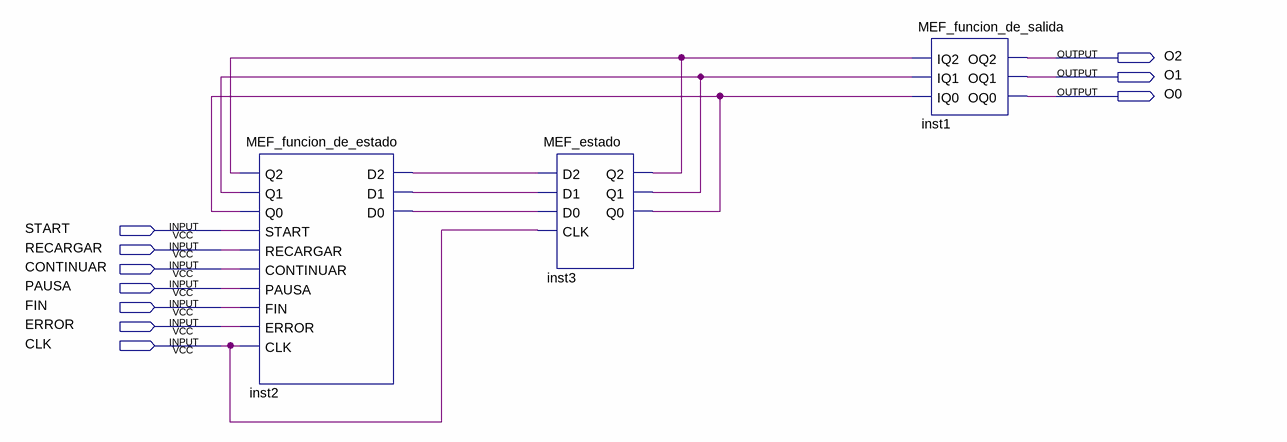
[diagram p0: schematic sheet]
// Quartus schematic MEF.bdf as structural Verilog: 3 symbols, 10 pins
module MEF (
  input  START,
  input  RECARGAR,
  input  CONTINUAR,
  input  PAUSA,
  input  FIN,
  input  ERROR,
  input  CLK,
  output O2,
  output O1,
  output O0
);

  wire inst2_d0, inst2_d1, inst2_d2, inst3_q0, inst3_q1, inst3_q2;

  MEF_funcion_de_estado inst2 (
    .Q2(inst3_q2), .Q1(inst3_q1), .Q0(inst3_q0), .START(START), .RECARGAR(RECARGAR), .CONTINUAR(CONTINUAR),
    .PAUSA(PAUSA), .FIN(FIN), .ERROR(ERROR), .CLK(CLK), .D2(inst2_d2), .D1(inst2_d1), .D0(inst2_d0));
  MEF_estado inst3 (
    .D2(inst2_d2), .D1(inst2_d1), .D0(inst2_d0), .CLK(CLK), .Q2(inst3_q2), .Q1(inst3_q1), .Q0(inst3_q0));
  MEF_funcion_de_salida inst1 (.IQ2(inst3_q2), .IQ1(inst3_q1), .IQ0(inst3_q0), .OQ2(O2), .OQ1(O1), .OQ0(O0));
endmodule
